# EAGLE design sfx (EAGLE 6.3)
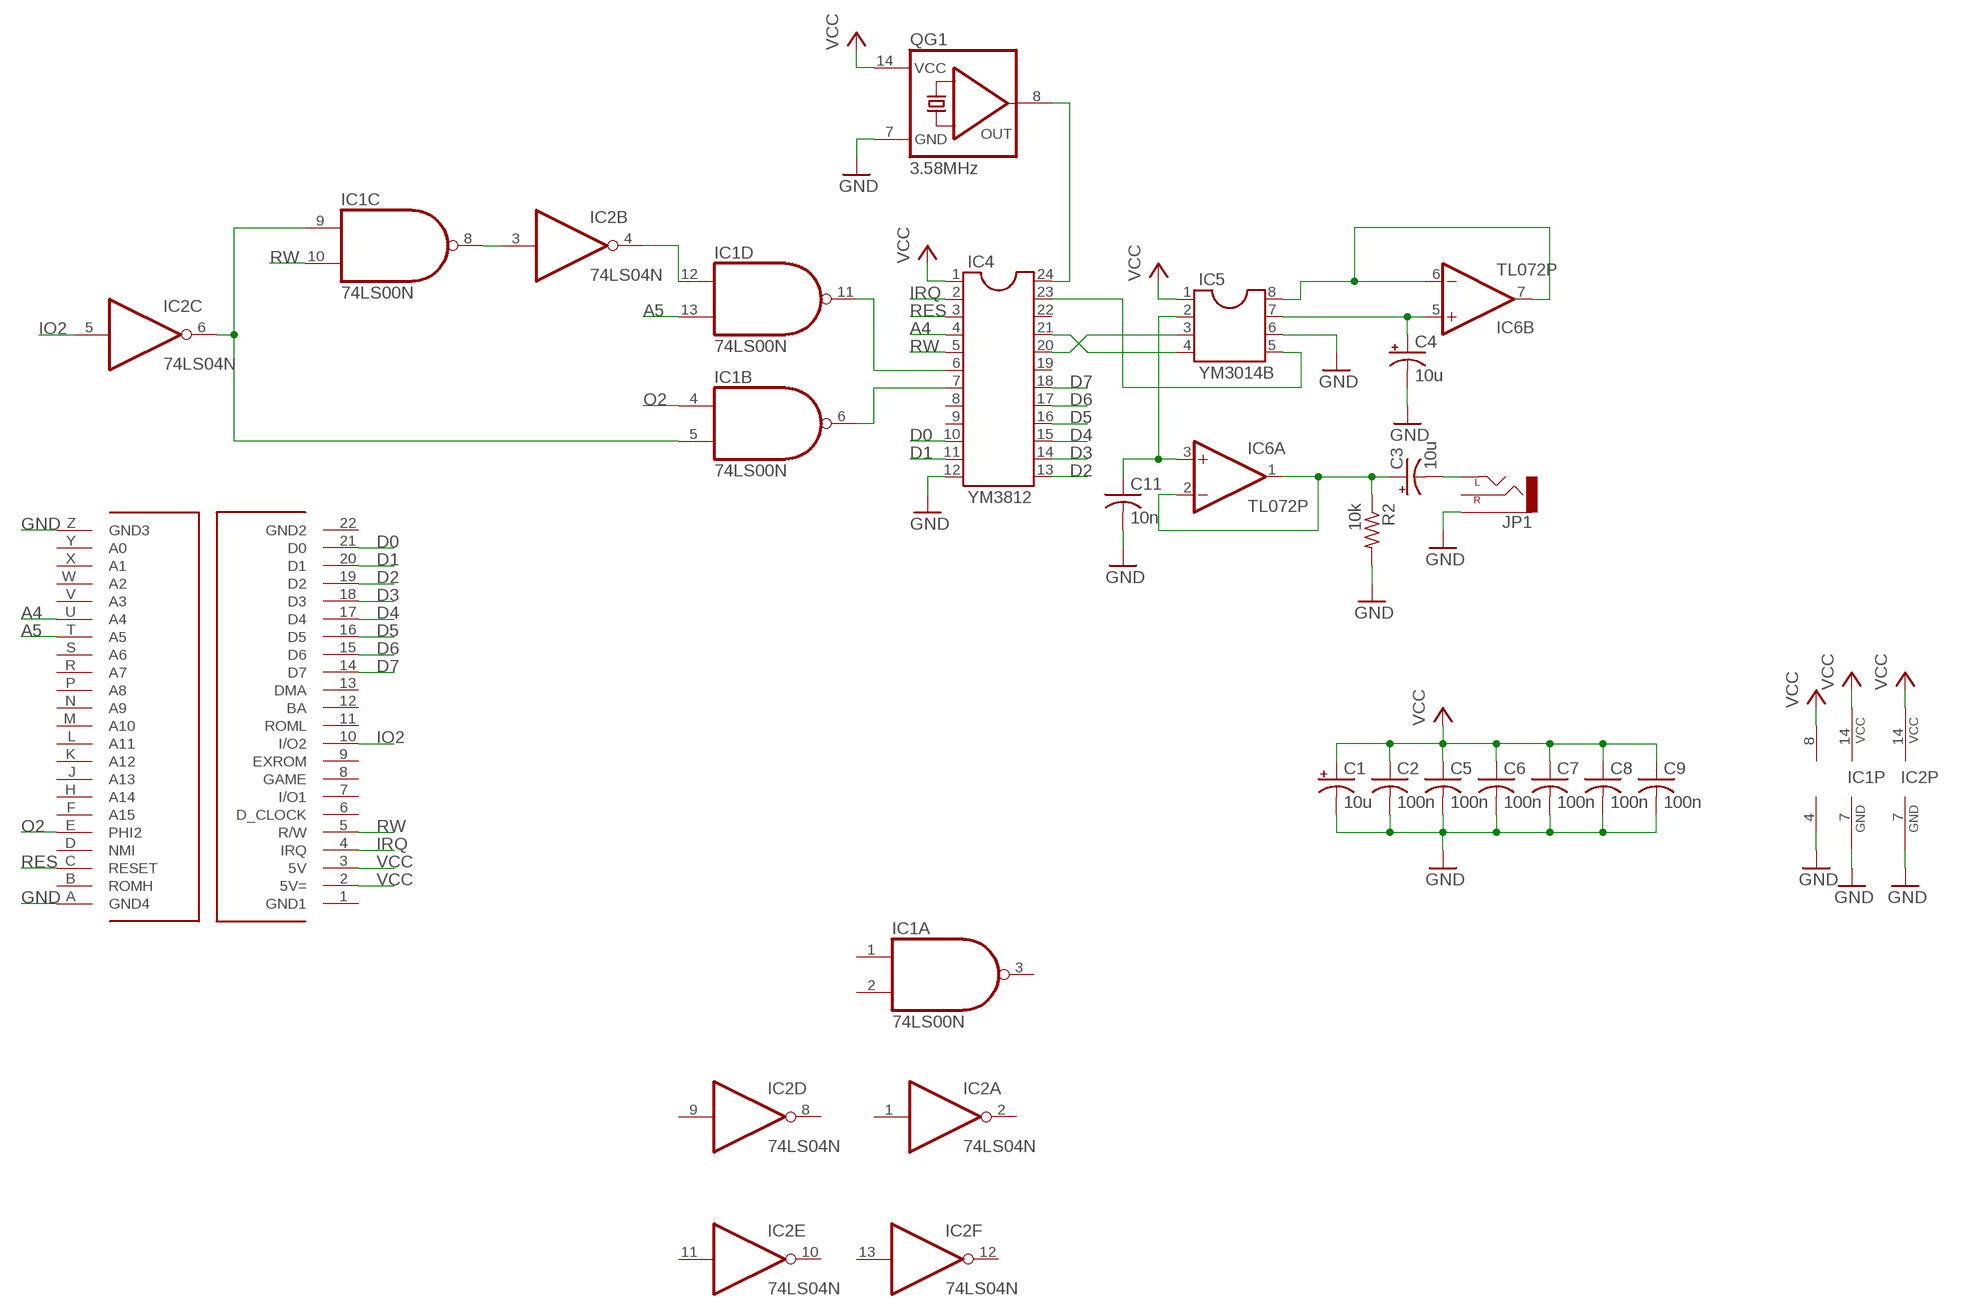
[diagram p0: schematic, sheet 1]

## Parts
C1  10u  CPOL-USE2.5-6  [E2,5-6]
C2  100n  C-US025-025X050  [C025-025X050]
C3  10u  CPOL-USE2.5-6  [E2,5-6]
C4  10u  CPOL-USE2.5-6  [E2,5-6]
C5  100n  C-US025-025X050  [C025-025X050]
C6  100n  C-US025-025X050  [C025-025X050]
C7  100n  C-US025-025X050  [C025-025X050]
C8  100n  C-US025-025X050  [C025-025X050]
C9  100n  C-US025-025X050  [C025-025X050]
C11  10n  C-US025-025X050  [C025-025X050]
IC1  74LS00N  [DIL14]
IC2  74LS04N  [DIL14]
IC4  YM3812  DIL24-6  [DIL24-6]
IC5  YM3014B  DIL8  [DIL08]
IC6  TL072P  [DIL08]
JP1  AUDIO-JACKPTH  [AUDIO-JACK]
QG1  3.58MHz  QG5860  [DIL14S]
R2  10k  R-US_0204/7  [0204/7]
U$1  EASYFLASH_1.4.1_REV_B_C64_EXPANSION__CARTRIDGE  [EASYFLASH_1.4.1_REV_B_C64_EXPANSION__CARTRIDGE]

## Nets
A4: IC4.4 U$1.U(A4)
A5: IC1.13(D:I1) U$1.T(A5)
D0: IC4.10 U$1.21(D0)
D1: IC4.11 U$1.20(D1)
D2: IC4.13 U$1.19(D2)
D3: IC4.14 U$1.18(D3)
D4: IC4.15 U$1.17(D4)
D5: IC4.16 U$1.16(D5)
D6: IC4.17 U$1.15(D6)
D7: IC4.18 U$1.14(D7)
GND: C1.- C2.2 C4.- C5.2 C6.2 C7.2 C8.2 C9.2 C11.2 IC1.7(P:GND) IC2.7(P:GND) IC4.12 IC5.6 IC6.4(P:V-) JP1.SLEEVE QG1.7(GND) R2.2 U$1.A(GND4) U$1.Z(GND3)
IO2: IC2.5(C:I) U$1.10(I/O2)
IRQ: IC4.2 U$1.4(IRQ)
N$1: IC4.24 QG1.8(OUT)
N$2: IC4.23 IC5.5
N$3: IC4.21 IC5.4
N$4: IC4.20 IC5.3
N$5: C11.1 IC5.2 IC6.3(A:+IN)
N$6: IC1.12(D:I0) IC2.4(B:O)
N$7: IC1.11(D:O) IC4.6
N$8: IC1.6(B:O) IC4.7
N$9: IC5.8 IC6.6(B:-IN) IC6.7(B:OUT)
N$10: IC1.8(C:O) IC2.3(B:I)
N$11: IC1.5(B:I1) IC1.9(C:I0) IC2.6(C:O)
N$12: C3.- JP1.TIP(LEFT)
N$13: C4.+ IC5.7 IC6.5(B:+IN)
N$14: C3.+ IC6.1(A:OUT) IC6.2(A:-IN) R2.1
O2: IC1.4(B:I0) U$1.E(PHI2)
RES: IC4.3 U$1.C(RESET)
RW: IC1.10(C:I1) IC4.5 U$1.5(R/W)
VCC: C1.+ C2.1 C5.1 C6.1 C7.1 C8.1 C9.1 IC1.14(P:VCC) IC2.14(P:VCC) IC4.1 IC5.1 IC6.8(P:V+) QG1.14(VCC) U$1.2(5V=) U$1.3(5V)
Unconnected: IC1.1(A:I0) IC1.2(A:I1) IC1.3(A:O) IC2.1(A:I) IC2.2(A:O) IC2.8(D:O) IC2.9(D:I) IC2.10(E:O) IC2.11(E:I) IC2.12(F:O) IC2.13(F:I) IC4.8 IC4.9 IC4.19 IC4.22 JP1.RING(RIGHT) U$1.1(GND1) U$1.6(D_CLOCK) U$1.7(I/O1) U$1.8(GAME) U$1.9(EXROM) U$1.11(ROML) U$1.12(BA) U$1.13(DMA) U$1.22(GND2) U$1.B(ROMH) U$1.D(NMI) U$1.F(A15) U$1.H(A14) U$1.J(A13) U$1.K(A12) U$1.L(A11) U$1.M(A10) U$1.N(A9) U$1.P(A8) U$1.R(A7) U$1.S(A6) U$1.V(A3) U$1.W(A2) U$1.X(A1) U$1.Y(A0)

## Library data of the parts
C1 C3 C4 = rcl:CPOL-US: POLARIZED CAPACITOR, American symbol
C2 C5-C9 C11 = rcl:C-US: CAPACITOR, American symbol
IC1 = 74xx-us:74*00: Quad 2-input NAND gate
IC2 = 74xx-us:74*04: Hex INVERTER
IC4 = ic-package:DIL24: Dual In Line
IC5 = ic-package:DIL8: Dual In Line / Socket
IC6 = linear:TL072: OP AMP
JP1 = SparkFun-Connectors:AUDIO-JACK: 3.5mm Audio Jack Simple 3.5mm common PCB mount audio jack. Variant PTH is our storefront SKU PRT-08032
QG1 = crystal:QG5860: CRYSTAL RESONATOR; OC_FARNELL: unknown; OC_NEWARK: unknown
R2 = rcl:R-US_: RESISTOR, American symbol
U$1 = sfx:EASYFLASH_1.4.1_REV_B_C64_EXPANSION__CARTRIDGE

## Board
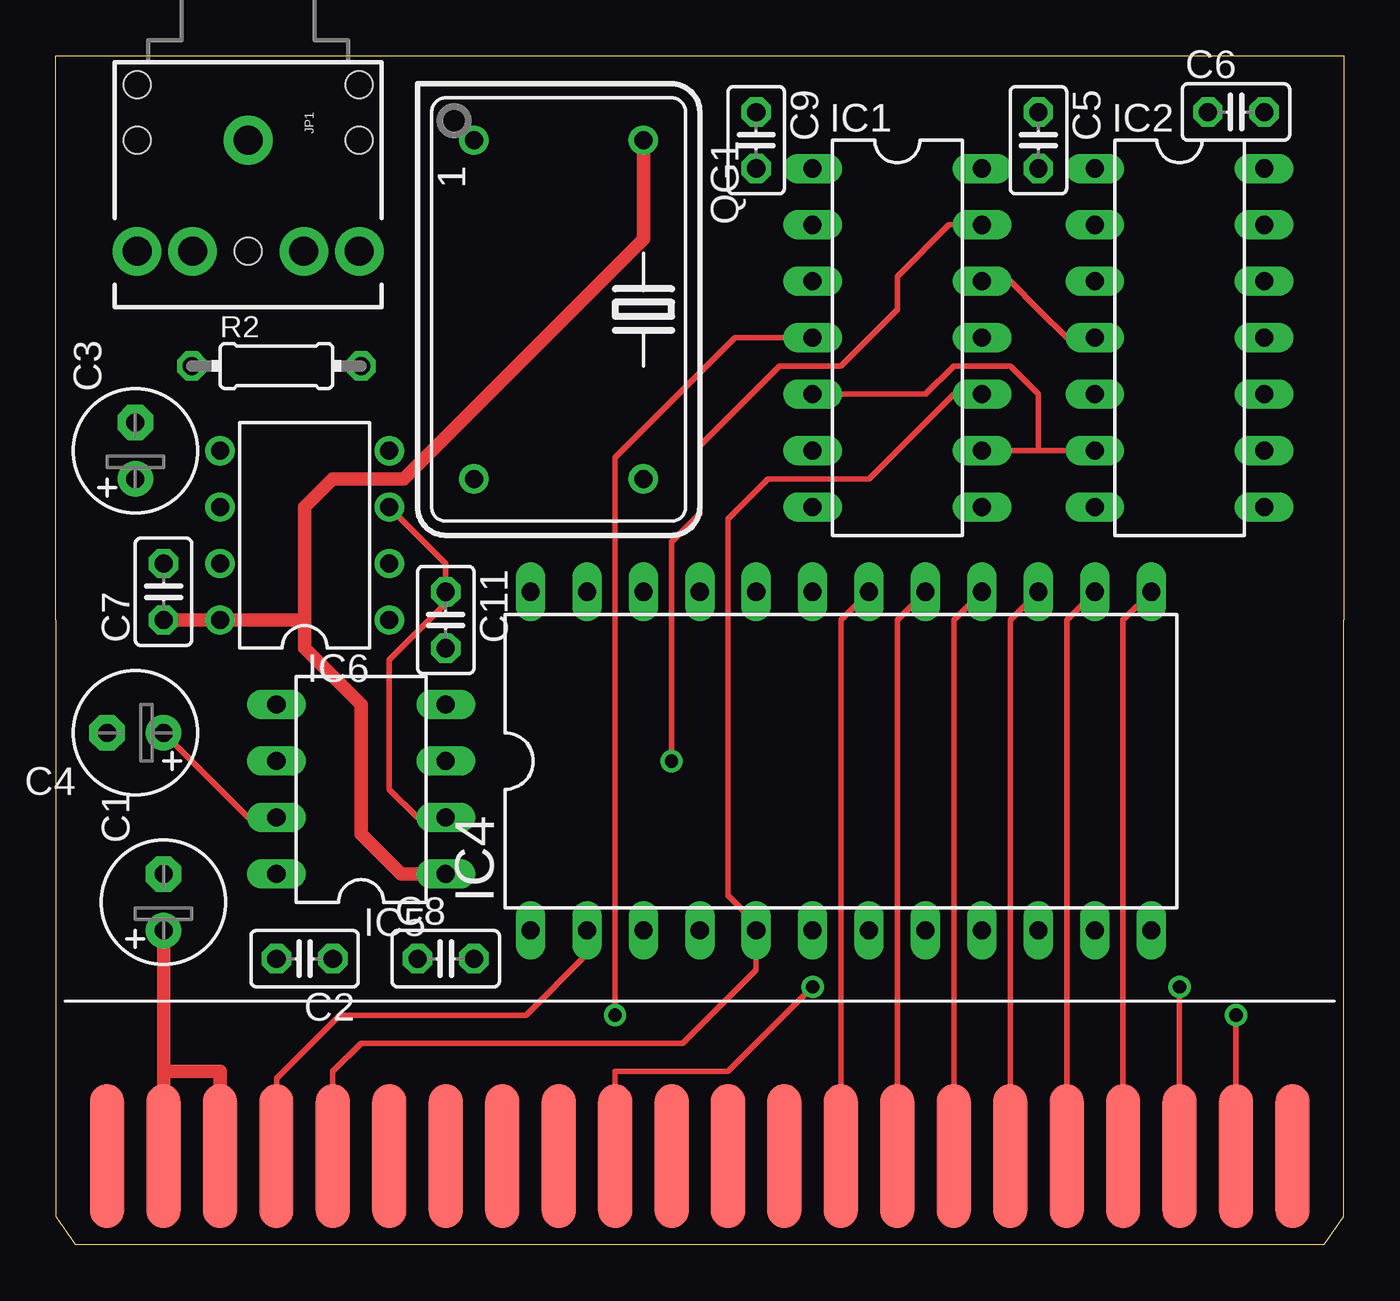
[diagram p1: board, top side]
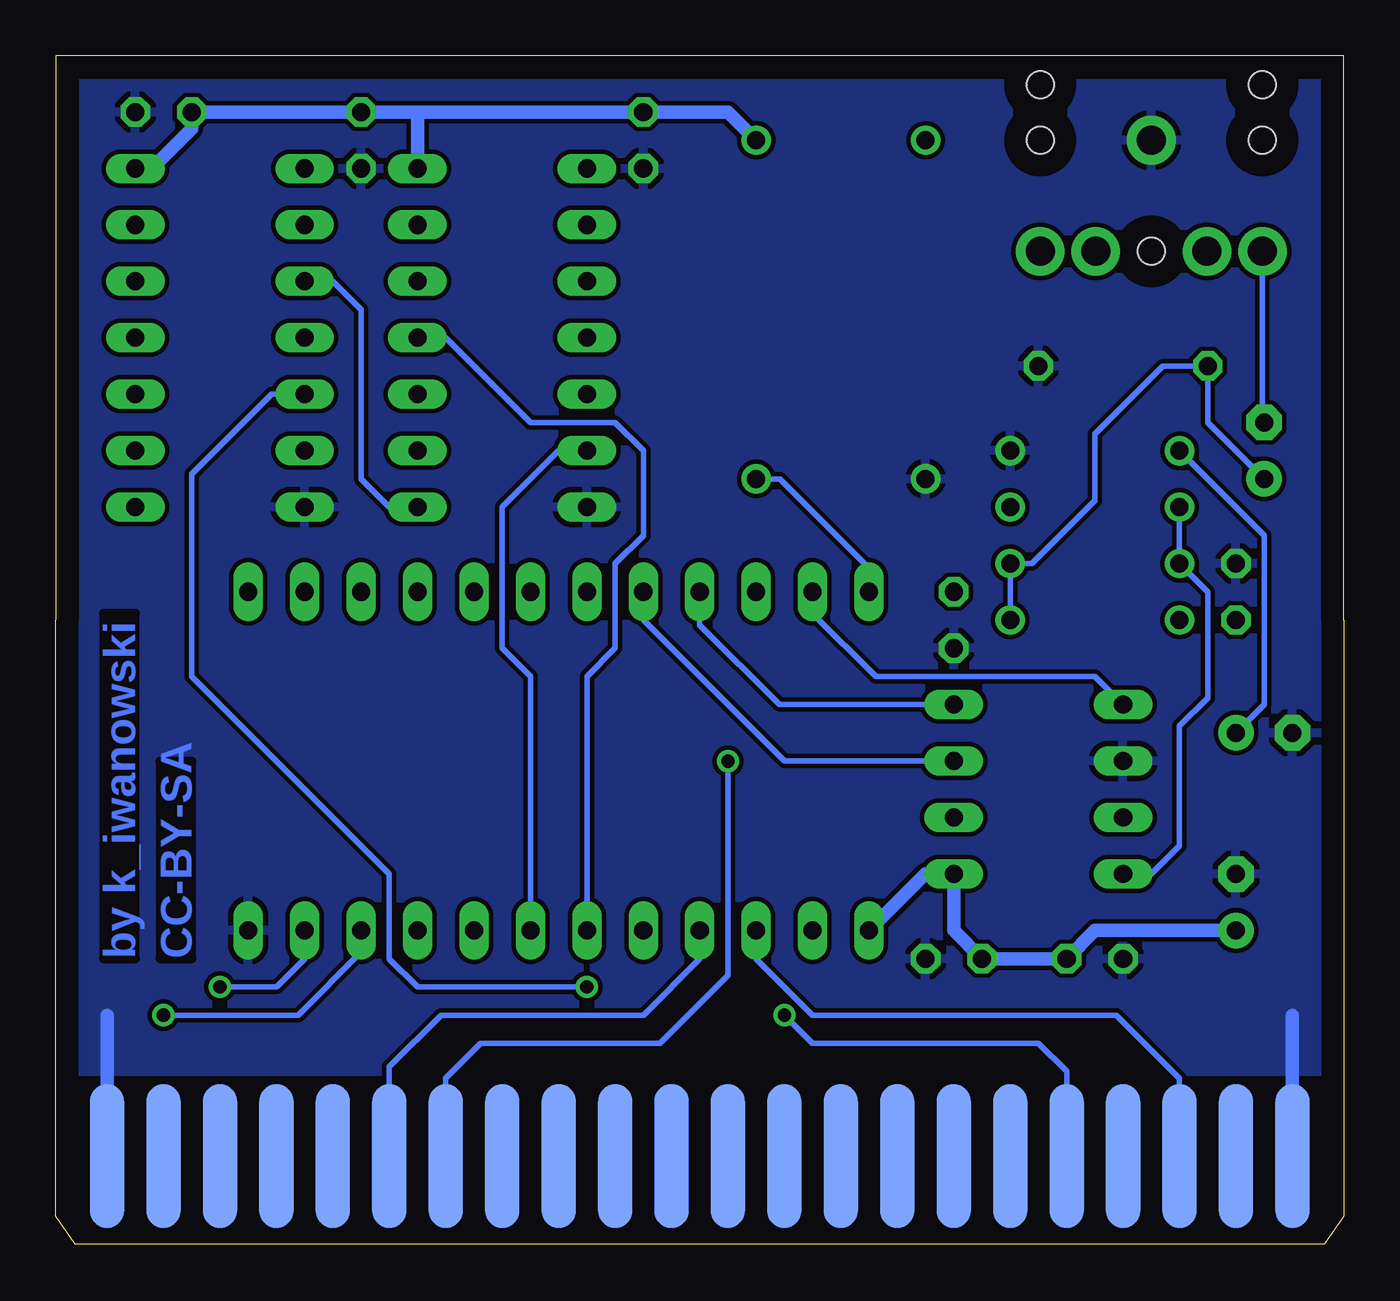
[diagram p2: board, bottom side, seen from below]

Size 57.98 x 53.5 mm. Coordinates in mm from the lower left corner, seen from the top.
Outline: 0,28.1 0,53.5 57.98,53.5 57.98,28.1
Copper layers (1*16): Top 0.035mm / dielectric 1.5mm / Bottom 0.035mm
Design rules "default": minimum track width 10mil, minimum drill 24mil, track to track 8mil, track to pad 8mil, pad to pad 8mil, via to via 8mil, smd to smd 8mil, copper to edge 40mil, drill to drill 8mil, minimum pad ring 10mil, minimum via ring 8mil, stop-mask expansion 4mil, vias tented up to drill 0mil, thermal gap 10mil

### Footprints (pad centres in the part's own frame; a part is rotated, then mirrored left to right if it is on the bottom)
E2,5-6 = drill 0.813 pad 1.6: + -1.27,0 | drill 0.813 pad 1.6 octagon: - 1.27,0
C025-025X050 = drill 0.813 octagon: 1 -1.27,0; 2 1.27,0
DIL14 = drill 0.813 long: 1 -7.62,-3.81; 2 -5.08,-3.81; 3 -2.54,-3.81; 4 0,-3.81; 5 2.54,-3.81; 6 5.08,-3.81; 7 7.62,-3.81; 8 7.62,3.81; 9 5.08,3.81; 10 2.54,3.81; 11 0,3.81; 12 -2.54,3.81; 13 -5.08,3.81; 14 -7.62,3.81
DIL24-6 = drill 0.813 long: 1 -13.97,-7.62; 2 -11.43,-7.62; 3 -8.89,-7.62; 4 -6.35,-7.62; 5 -3.81,-7.62; 6 -1.27,-7.62; 7 1.27,-7.62; 8 3.81,-7.62; 9 6.35,-7.62; 10 8.89,-7.62; 11 11.43,-7.62; 12 13.97,-7.62; 13 13.97,7.62; 14 11.43,7.62; 15 8.89,7.62; 16 6.35,7.62; 17 3.81,7.62; 18 1.27,7.62; 19 -1.27,7.62; 20 -3.81,7.62; 21 -6.35,7.62; 22 -8.89,7.62; 23 -11.43,7.62; 24 -13.97,7.62
DIL08 = drill 0.813 long: 1 -3.81,-3.81; 2 -1.27,-3.81; 3 1.27,-3.81; 4 3.81,-3.81; 5 3.81,3.81; 6 1.27,3.81; 7 -1.27,3.81; 8 -3.81,3.81
DIL08' = drill 0.813 pad 1.27: 1 -3.81,-3.81; 2 -1.27,-3.81; 3 1.27,-3.81; 4 3.81,-3.81; 5 3.81,3.81; 6 1.27,3.81; 7 -1.27,3.81; 8 -3.81,3.81
AUDIO-JACK = drill 1.3 pad 2.184: RING 5,5; RSH 5,2.5; SLEEVE 0,0; TIP 5,-5; TSH 5,-2.5 | hole 1.2: 0,5; -2.5,5; -2.5,-5; 0,-5; 5,0
DIL14S = drill 0.813: 1 -7.62,-3.81; 7 7.62,-3.81; 8 7.62,3.81; 14 -7.62,3.81
0204/7 = drill 0.813 octagon: 1 -3.81,0; 2 3.81,0
EASYFLASH_1.4.1_REV_B_C64_EXPANSION__CARTRIDGE = smd 1.524 x 6.477: 1 -52.07,-24.13; 2 -49.53,-24.13; 3 -46.99,-24.13; 4 -44.45,-24.13; 5 -41.91,-24.13; 6 -39.37,-24.13; 7 -36.83,-24.13; 8 -34.29,-24.13; 9 -31.75,-24.13; 10 -29.21,-24.13; 11 -26.67,-24.13; 12 -24.13,-24.13; 13 -21.59,-24.13; 14 -19.05,-24.13; 15 -16.51,-24.13; 16 -13.97,-24.13; 17 -11.43,-24.13; 18 -8.89,-24.13; 19 -6.35,-24.13; 20 -3.81,-24.13; 21 -1.27,-24.13; 22 1.27,-24.13 | smd 1.524 x 6.477 bottom: A -52.07,-24.13; B -49.53,-24.13; C -46.99,-24.13; D -44.45,-24.13; E -41.91,-24.13; F -39.37,-24.13; H -36.83,-24.13; J -34.29,-24.13; K -31.75,-24.13; L -29.21,-24.13; M -26.67,-24.13; N -24.13,-24.13; P -21.59,-24.13; R -19.05,-24.13; S -16.51,-24.13; T -13.97,-24.13; U -11.43,-24.13; V -8.89,-24.13; W -6.35,-24.13; X -3.81,-24.13; Y -1.27,-24.13; Z 1.27,-24.13

### Placement (x,y rotation side)
C1  4.86,15.4 90 top
C2  11.21,12.86 180 top
C3  3.59,35.72 90 top
C4  3.59,23.02 180 top
C5  44.23,49.69 270 top
C6  53.12,50.96 0 top
C7  4.86,29.37 90 top
C8  17.56,12.86 0 top
C9  31.53,49.69 270 top
C11  17.56,28.1 270 top
IC1  37.88,40.8 270 top
IC2  50.58,40.8 270 top
IC4  35.34,21.75 0 top
IC5  13.75,20.48 90 top
IC6  TL072P  [DIL08']  11.21,31.91 90 top
JP1  8.67,49.69 270 top
QG1  22.64,42.07 270 top
R2  9.94,39.53 0 top
U$1  54.39,28.1 0 top

### Tracks (layer width: path | path; a pad name or v marks a point on that pad's centre or on a via)
A4
  Bottom 0.254: IC4.4 28.99,12.86 31.53,10.32 40.64,10.32 42.96,8 U$1.U
A5  (via drill 0.6)
  Top 0.254: v27.72,21.75 27.72,31.61 28.99,32.88 28.99,35.94 32.58,39.53 35.34,39.53 37.88,42.07 37.88,43.56 40.2,45.88 IC1.13
  Bottom 0.254: v27.72,21.75 27.72,12.11 30.78,9.05 38.85,9.05 40.42,7.48 U$1.T
D0  (via drill 0.6)
  Top 0.254: v53.12,10.32 U$1.21
  Bottom 0.254: IC4.10 44.23,13.16 47.07,10.32 v53.12,10.32
D1  (via drill 0.6)
  Top 0.254: v50.58,11.59 U$1.20
  Bottom 0.254: IC4.11 46.77,12.86 48.04,11.59 v50.58,11.59
D2
  Top 0.254: IC4.13 48.04,28.1 U$1.19
D3
  Top 0.254: IC4.14 45.5,28.1 U$1.18
D4
  Top 0.254: IC4.15 42.96,28.1 U$1.17
D5
  Top 0.254: IC4.16 40.42,28.1 U$1.16
D6
  Top 0.254: IC4.17 37.88,28.1 U$1.15
D7
  Top 0.254: IC4.18 35.34,28.1 U$1.14
GND
  Bottom 0.61: U$1.A 2.32,10.32 | U$1.Z 55.66,10.32
  pour Bottom: 1.05,52.23 56.93,52.23 56.93,7.78 1.05,7.78
IO2  (via drill 0.6)
  Top 0.254: U$1.10 25.18,7.78 30.26,7.78 v34.07,11.59
  Bottom 0.254: v34.07,11.59 41.69,11.59 42.96,12.86 42.96,16.67 51.85,25.56 51.85,34.67 48.26,38.26 IC2.5
IRQ
  Top 0.254: U$1.4 9.94,7.48 12.78,10.32 21.16,10.32 23.91,13.06 IC4.2
N$1
  Bottom 0.254: QG1.8 25.38,34.45 21.37,30.43 IC4.24
N$2
  Bottom 0.254: IC4.23 23.91,28.4 21.07,25.56 11.21,25.56 IC5.5
N$3
  Bottom 0.254: IC5.4 25.4,24.29 28.99,27.88 IC4.21
N$4
  Bottom 0.254: IC5.3 25.18,21.75 31.53,28.1 IC4.20
N$5
  Top 0.254: IC6.3 17.56,30.64 C11.1 17.56,28.84 16.81,28.1 15.02,26.3 15.02,20.48 16.29,19.21 IC5.2
N$6
  Top 0.254: IC2.4 45.5,40.8 44.23,42.07 42.96,43.34 IC1.12
N$7
  Bottom 0.254: IC1.11 40.42,40.8 36.61,36.99 32.8,36.99 31.53,35.72 31.53,31.91 32.8,30.64 32.8,26.83 34.07,25.56 IC4.6
N$8
  Bottom 0.254: IC1.6 35.34,35.72 37.88,33.18 37.88,26.83 36.61,25.56 IC4.7
N$9
  Bottom 0.254: IC5.8 8.67,16.67 7.4,17.94 7.4,23.33 6.13,24.6 6.13,29.37 IC6.7 IC6.6
N$10
  Bottom 0.254: IC1.8 42.96,33.18 44.23,34.45 44.23,42.07 45.5,43.34 IC2.3
N$11
  Top 0.254: IC1.9 44.23,35.72 | 44.23,35.72 IC2.6 | IC1.5 39.15,38.26 40.42,39.53 42.96,39.53 44.23,38.26 44.23,35.72
N$12
  Bottom 0.254: C3.- 3.67,36.99 JP1.TIP
N$13
  Top 0.254: IC5.7 8.67,19.21 C4.+
  Bottom 0.254: C4.+ 3.59,24.29 3.59,31.91 IC6.5
N$14
  Bottom 0.254: IC6.1 IC6.2 14.05,30.64 11.21,33.48 11.21,36.46 8.14,39.53 R2.1 6.13,36.99 C3.+
O2  (via drill 0.6)
  Top 0.254: v25.18,10.32 25.18,35.41 30.57,40.8 IC1.4
  Bottom 0.254: v25.18,10.32 23.91,9.05 13.75,9.05 12.48,7.78 U$1.E
RES
  Bottom 0.254: U$1.C 7.4,7.48 10.24,10.32 23.91,10.32 26.45,12.86 IC4.3
RW
  Top 0.254: U$1.5 12.48,7.78 13.75,9.05 28.22,9.05 31.53,12.36 IC4.5 31.53,14.43 30.26,15.7 30.26,32.65 32.05,34.45 36.61,34.45 39.15,36.99 40.42,38.26 IC1.10
VCC
  Top 0.61: U$1.3 7.4,7.78 4.86,7.78 | U$1.2 4.86,7.78 | 11.21,28.1 IC6.8 C7.1 | 4.86,7.78 C1.+ | IC5.1 15.54,16.67 13.75,18.46 13.75,24.29 11.21,26.83 11.21,28.1 | 11.21,28.1 11.21,33.18 12.48,34.45 15.67,34.45 26.45,45.23 QG1.14
  Bottom 0.61: IC4.1 18.83,16.67 IC5.1 17.56,14.13 C8.1 C2.1 11.21,14.13 C1.+ | 41.69,50.96 C9.1 27.72,50.96 QG1.14 | 41.69,50.96 C5.1 C6.1 51.85,50.21 53.64,48.42 IC2.14 | IC1.14 41.69,50.96

### Text on the board
Bottom: CC-BY-SA | by k_iwanowski